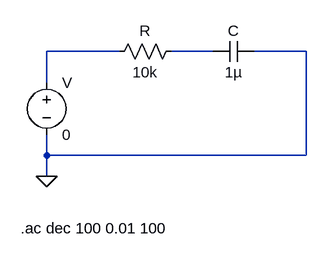
[diagram p0: schematic T3_1_RC_ac.asc]
T3_1_RC_ac.asc, the LTspice schematic file:
Version 4
SHEET 1 880 680
WIRE 240 32 128 32
WIRE 384 32 320 32
WIRE 528 32 448 32
WIRE 128 80 128 32
WIRE 128 192 128 160
WIRE 528 192 528 32
WIRE 528 192 128 192
WIRE 128 224 128 192
FLAG 128 224 0
SYMBOL res 336 16 R90
WINDOW 0 0 56 VBottom 2
WINDOW 3 32 56 VTop 2
SYMATTR InstName R
SYMATTR Value 10k
SYMBOL cap 448 16 R90
WINDOW 0 0 32 VBottom 2
WINDOW 3 32 32 VTop 2
SYMATTR InstName C
SYMATTR Value 1µ
SYMBOL voltage 128 64 R0
SYMATTR InstName V
SYMATTR Value 0
SYMATTR Value2 AC 1
TEXT 88 304 Left 2 !.ac dec 100 0.01 100

The netlist it stands for:
* T3_1_RC_ac.asc
R N002 N001 10k
C 0 N002 1µ
V N001 0 0 AC 1
.ac dec 100 0.01 100
.backanno
.end